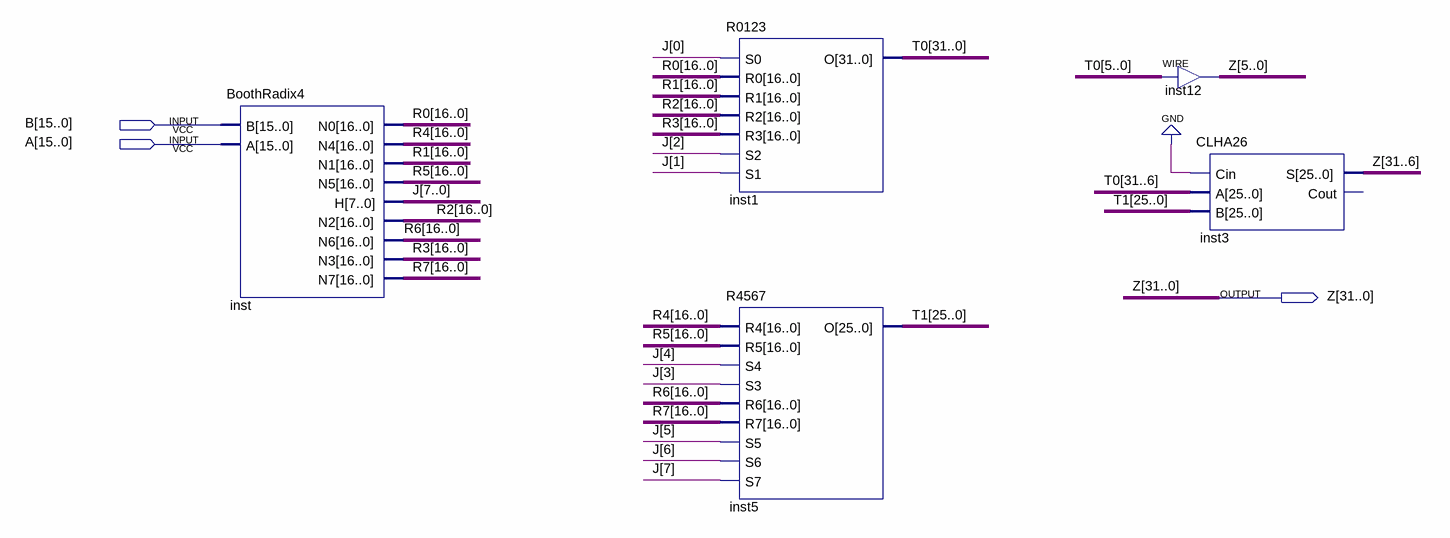
[diagram p0: schematic sheet]
// Quartus schematic mul16x16.bdf as structural Verilog: 5 symbols, 3 pins
module mul16x16 (
  input  [15:0] B,
  input  [15:0] A,
  output [31:0] Z
);

  wire [7:0] J;
  wire [16:0] R0, R1, R2, R3, R4, R5, R6, R7;
  wire [25:0] T1;
  wire [31:0] T0;

  BoothRadix4 inst (.B(B), .A(A), .N0(R0), .N4(R4), .N1(R1), .N5(R5), .H(J), .N2(R2), .N6(R6), .N3(R3), .N7(R7));
  R0123 inst1 (.S0(J[0]), .R0(R0), .R1(R1), .R2(R2), .R3(R3), .S2(J[2]), .S1(J[1]), .O(T0));
  R4567 inst5 (.R4(R4), .R5(R5), .S4(J[4]), .S3(J[3]), .R6(R6), .R7(R7), .S5(J[5]), .S6(J[6]), .S7(J[7]), .O(T1));
  assign Z[5:0] = T0[5:0];  // WIRE inst12
  CLHA26 inst3 (.Cin(1'b0), .A(T0[31:6]), .B(T1), .S(Z[31:6]));  // open: Cout
endmodule
